# EAGLE design tester (EAGLE 7.7.0)
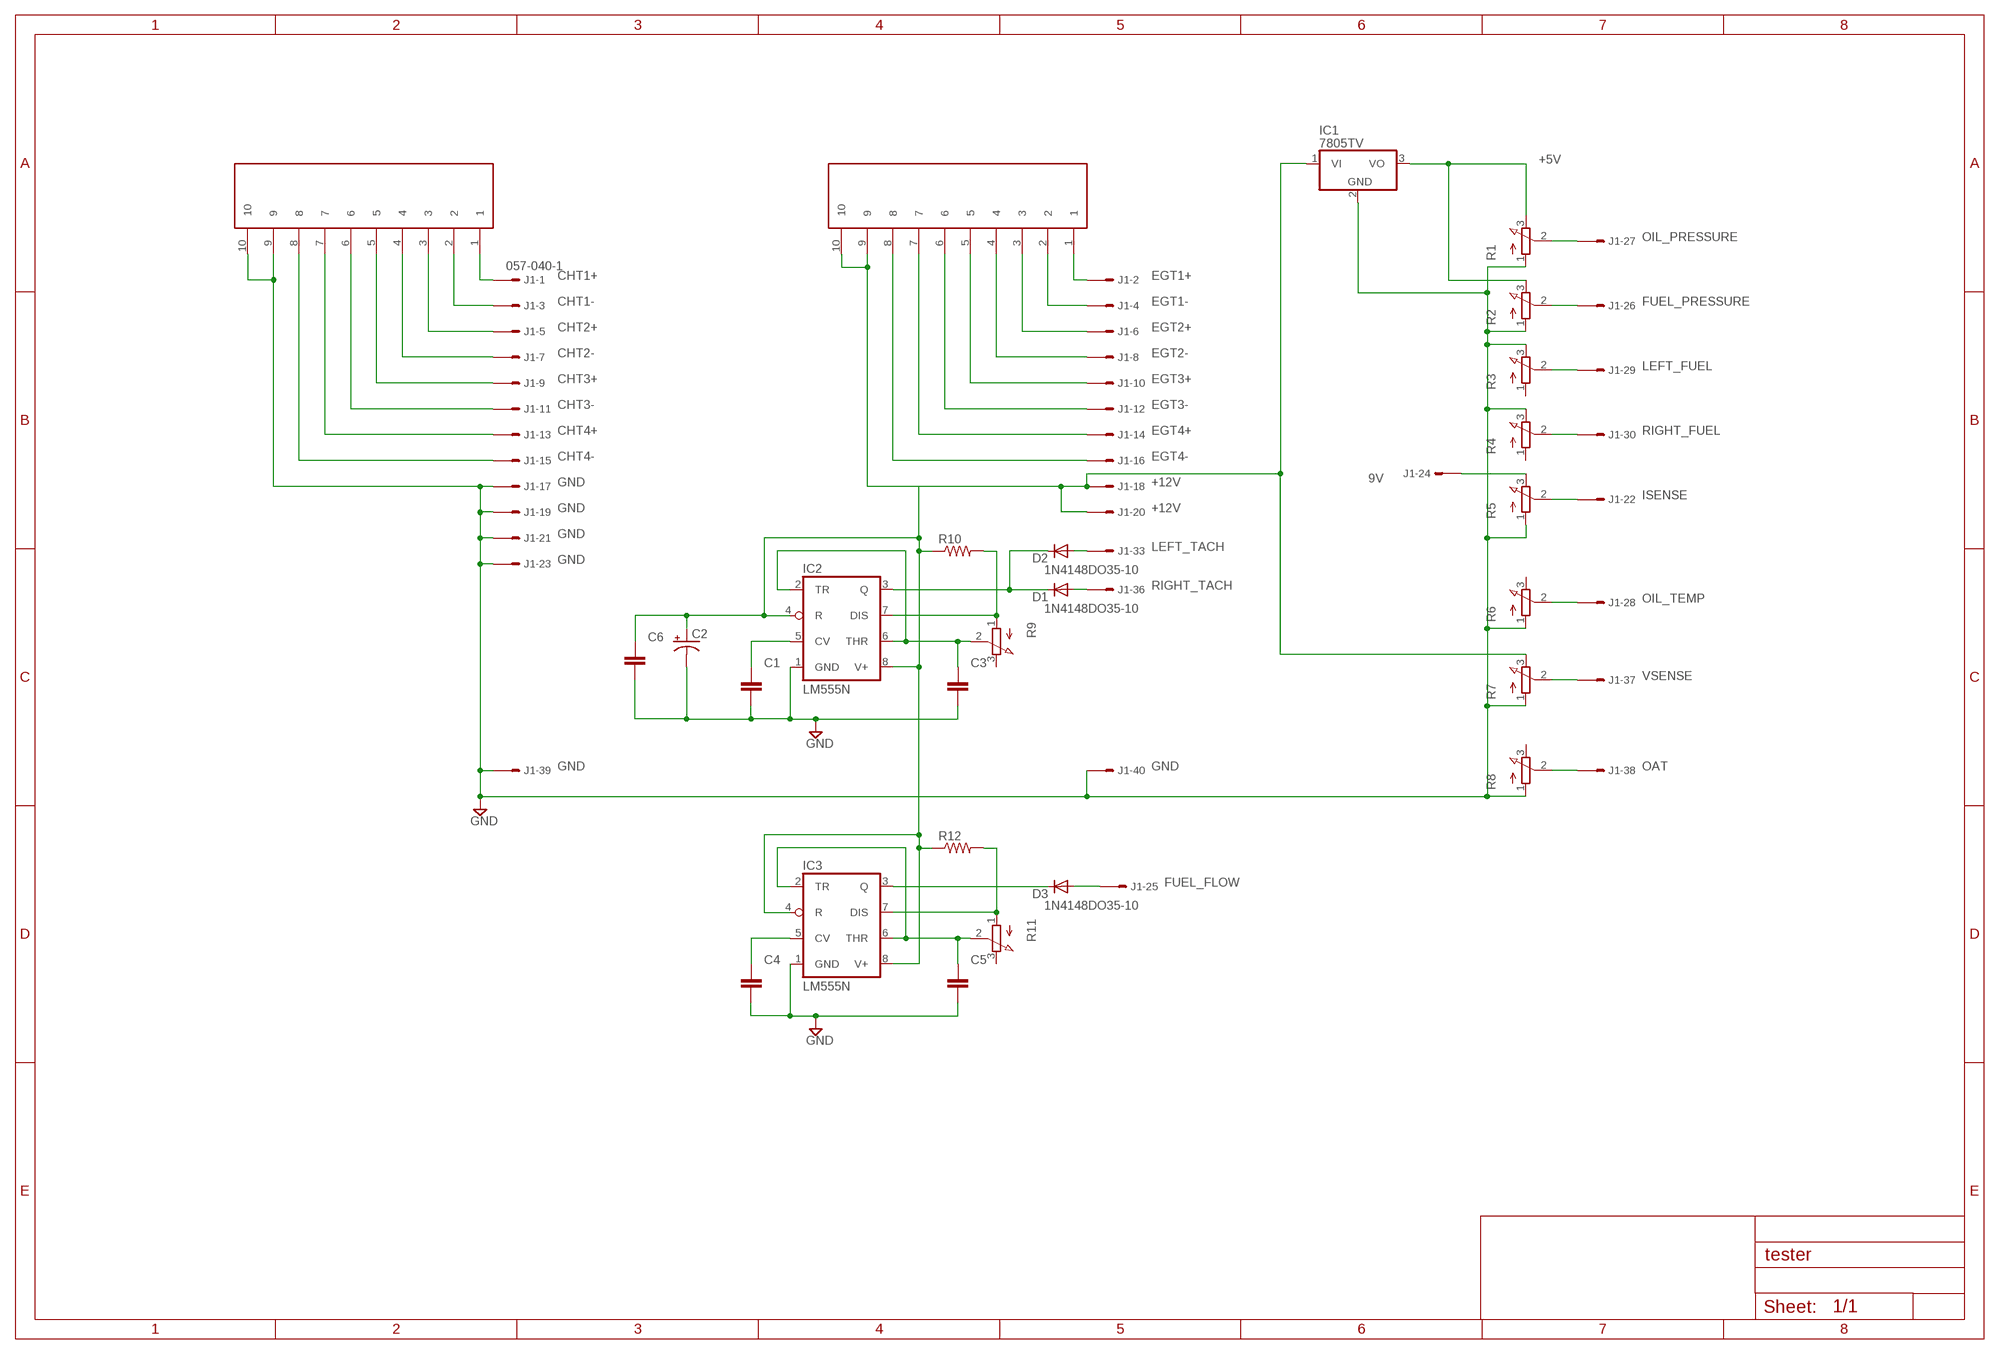
[diagram p0: schematic, sheet 1]

## Parts
C1  CAPACITOR_NPOL-PTH_0.1"  [C0.1PTH]
C2  CAP_POLPTH2  [CPOL-RADIAL-10UF-25V]
C3  CAPACITOR_NPOL-PTH_0.1"  [C0.1PTH]
C4  CAPACITOR_NPOL-PTH_0.1"  [C0.1PTH]
C5  CAPACITOR_NPOL-PTH_0.1"  [C0.1PTH]
C6  CAPACITOR_NPOL-PTH_0.1"  [C0.1PTH]
D1  1N4148DO35-10  [DO35-10]
D2  1N4148DO35-10  [DO35-10]
D3  1N4148DO35-10  [DO35-10]
IC1  7805TV  [TO220V]
IC2  LM555N  [DIL08]
IC3  LM555N  [DIL08]
J1  057-040-1  [057-040-1]
R1  3RP/1610N  [3RP/1610N]
R2  3RP/1610N  [3RP/1610N]
R3  3RP/1610N  [3RP/1610N]
R4  3RP/1610N  [3RP/1610N]
R5  3RP/1610N  [3RP/1610N]
R6  3RP/1610N  [3RP/1610N]
R7  3RP/1610N  [3RP/1610N]
R8  3RP/1610N  [3RP/1610N]
R9  3RP/1610N  [3RP/1610N]
R10  RESISTORPTH-1/4W  [AXIAL-0.4]
R11  3RP/1610N  [3RP/1610N]
R12  RESISTORPTH-1/4W  [AXIAL-0.4]
TB2  282847-10  [282847-10]
TB4  282847-10  [282847-10]

## Nets
9V: J1.24 R5.3(E)
+5V: IC1.3(VO) R1.3(E) R2.3(E)
+12V: C2.1(+) C6.1 IC1.1(VI) IC2.4(R) IC2.8(V+) IC3.4(R) IC3.8(V+) J1.18 J1.20 R7.3(E) R10.P$1 R12.P$1 TB4.9 TB4.10
CHT1+: J1.1 TB2.1
CHT1-: J1.3 TB2.2
CHT2+: J1.5 TB2.3
CHT2-: J1.7 TB2.4
CHT3+: J1.9 TB2.5
CHT3-: J1.11 TB2.6
CHT4+: J1.13 TB2.7
CHT4-: J1.15 TB2.8
EGT1+: J1.2 TB4.1
EGT1-: J1.4 TB4.2
EGT2+: J1.6 TB4.3
EGT2-: J1.8 TB4.4
EGT3+: J1.10 TB4.5
EGT3-: J1.12 TB4.6
EGT4+: J1.14 TB4.7
EGT4-: J1.16 TB4.8
FF: C5.1 IC3.2(TR) IC3.6(THR) R11.2(S)
FUEL_FLOW: D3.A J1.25
FUEL_PRESSURE: J1.26 R2.2(S)
GND: C1.2 C2.2(-) C3.2 C4.2 C5.2 C6.2 IC1.2(GND) IC2.1(GND) IC3.1(GND) J1.17 J1.19 J1.21 J1.23 J1.39 J1.40 R1.1(A) R2.1(A) R3.3(E) R4.3(E) R5.1(A) R6.1(A) R7.1(A) R8.1(A) TB2.9 TB2.10
ISENSE: J1.22 R5.2(S)
LEFT_FUEL: J1.29 R3.2(S)
LEFT_TACH: D2.A J1.33
N$3: C1.1 IC2.5(CV)
N$4: IC2.7(DIS) R9.1(A) R10.P$2
N$7: D1.C D2.C IC2.3(Q)
N$8: C4.1 IC3.5(CV)
N$9: IC3.7(DIS) R11.1(A) R12.P$2
N$11: D3.C IC3.3(Q)
OAT: J1.38 R8.2(S)
OIL_PRESSURE: J1.27 R1.2(S)
OIL_TEMP: J1.28 R6.2(S)
RIGHT_FUEL: J1.30 R4.2(S)
RIGHT_TACH: D1.A J1.36
RPM: C3.1 IC2.2(TR) IC2.6(THR) R9.2(S)
VSENSE: J1.37 R7.2(S)
Unconnected: J1.31 J1.32 J1.34 J1.35 R3.1(A) R4.1(A) R6.3(E) R8.3(E) R9.3(E) R11.3(E)

## Library data of the parts
C1 C3-C6 = kotuku:CAPACITOR_NPOL: Non-Polarized capacitor in various packages
C2 = kotuku:CAP_POL: Capacitor Polarized These are standard SMD and PTH capacitors. Normally 10uF, 47uF, and 100uF in electrolytic and tantalum varieties. Always verify the external diameter of the through hole cap, it varies with capacity, voltage, and manufacturer. The EIA devices should be standard.
D1-D3 = diode:1N4148: DIODE high speed (Philips)
IC1 = linear:78*: Positive VOLTAGE REGULATOR Source: http://cache.national.com/ds/LM/LM78L05.pdf http://www.fairchildsemi.com/ds/LM/LM7805.pdf
IC2 IC3 = linear:*555: TIMER
J1 = con-panduit-changed:057-040-: CONNECTOR 40-pin series 057 contact pc board low profile headers; OC_FARNELL: unknown; OC_NEWARK: unknown; PARTNO: SBH11-PBPC-D20-ST-BK
R1-R9 R11 = pot:3RP/1610N: 16mm Potentiometer one level Source: http://www.alphapotentiometers.net/html/16mm_pot_2.html
R10 R12 = kotuku:RESISTOR: Resistor Basic schematic elements and footprints for 0603, 1206, and PTH resistors.
TB2 TB4 = TEConnectivity:282847-10; PARTNO: 1-282847-0

## Board
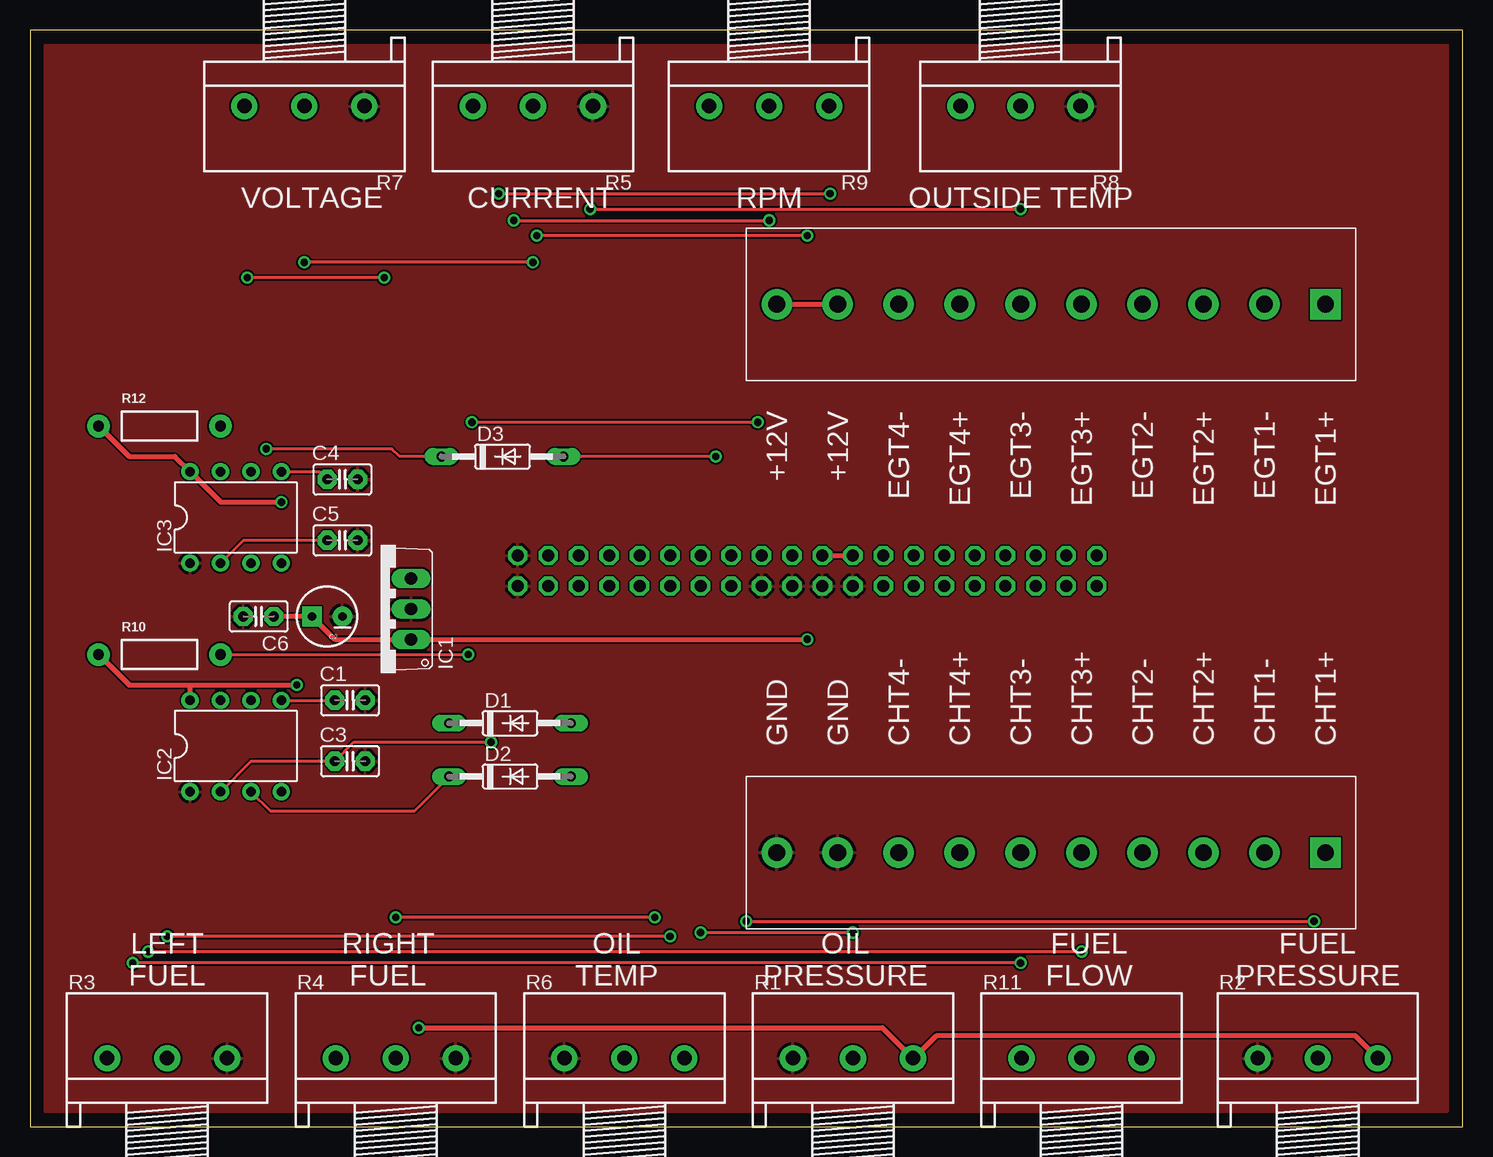
[diagram p1: board, top side]
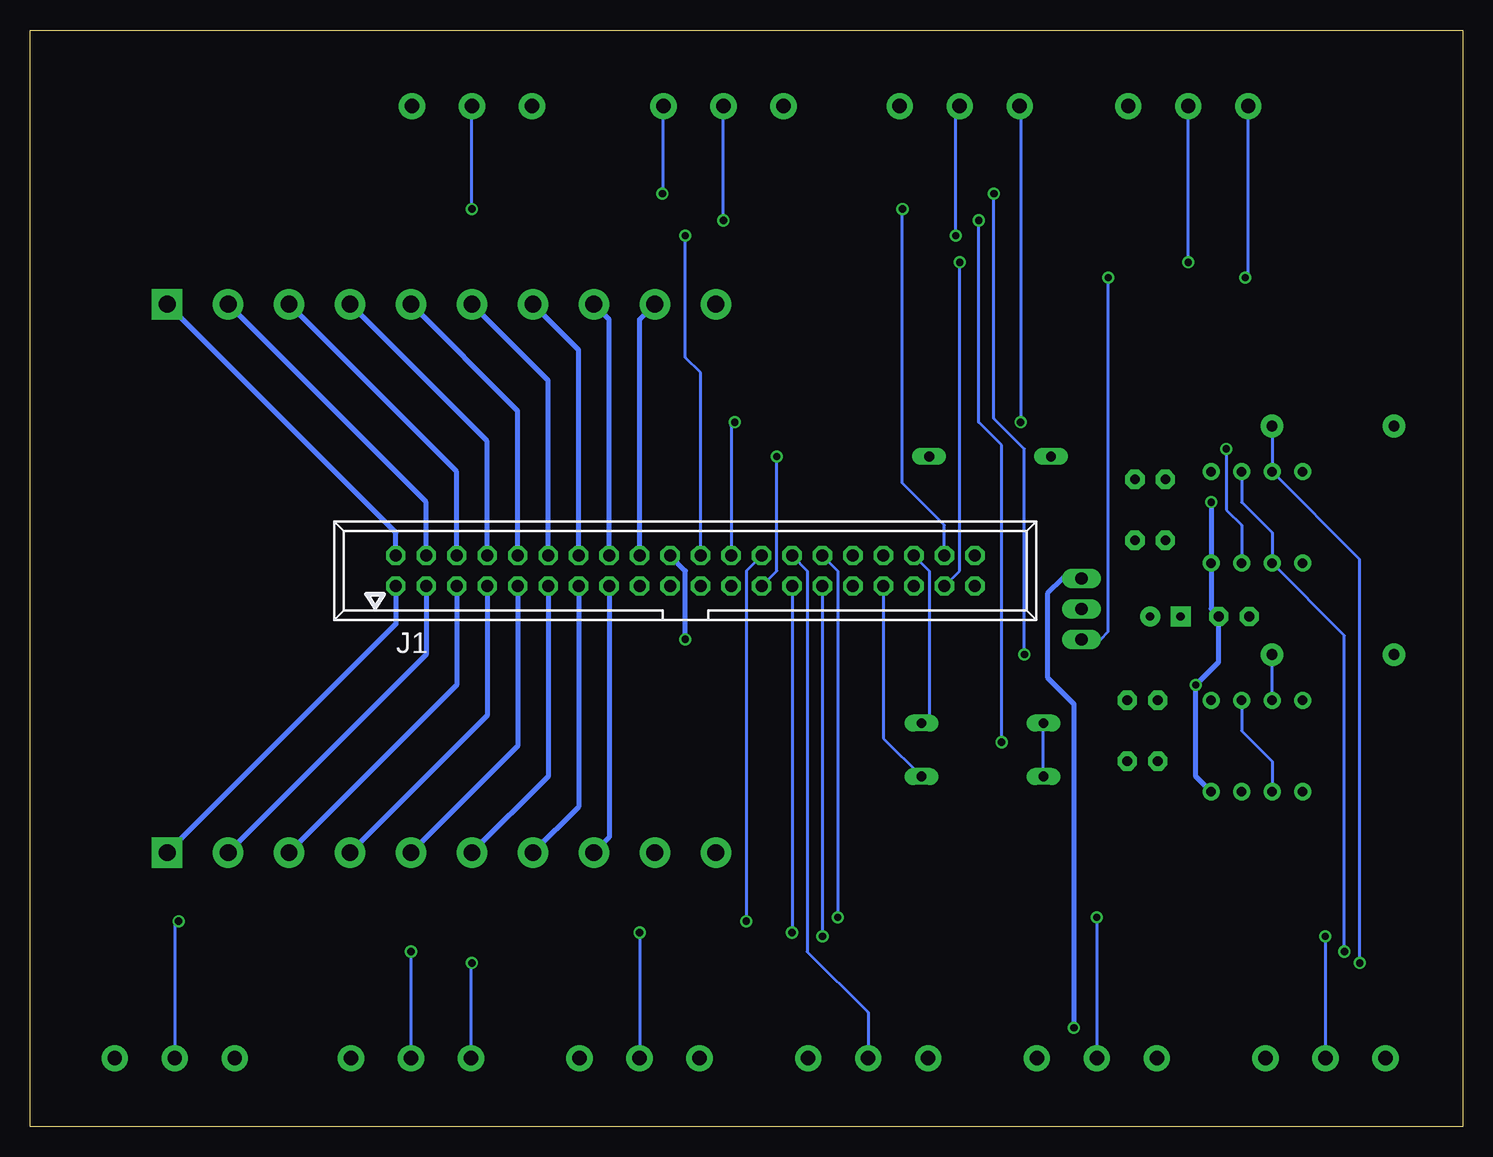
[diagram p2: board, bottom side, seen from below]

Size 119.38 x 91.44 mm. Coordinates in mm from the lower left corner, seen from the top.
Outline: 0,0 119.38,0 119.38,91.44 0,91.44 0,0
Copper layers (1*16): Top 0.035mm / dielectric 1.5mm / Bottom 0.035mm
Design rules "DFRobot_Eagle_Rule_v0.4": minimum track width 6mil, minimum drill 12mil, track to track 6mil, track to pad 6mil, pad to pad 6mil, via to via 6mil, smd to smd 0mil, copper to edge 10mil, drill to drill 10mil, minimum pad ring 12mil, minimum via ring 8mil, stop-mask expansion 2mil, vias tented up to drill 25mil, thermal gap 10mil

### Footprints (pad centres in the part's own frame; a part is rotated, then mirrored left to right if it is on the bottom)
C0.1PTH = drill 0.813 pad 1.6 octagon: 1 -1.27,0; 2 1.27,0
CPOL-RADIAL-10UF-25V = drill 0.7 pad 1.651 square: 1 1.27,0 | drill 0.7 pad 1.651: 2 -1.27,0
DO35-10 = drill 0.813 long: A 5.08,0; C -5.08,0
TO220V = drill 1.016 long: 1 -2.54,-2.54; 2 0,-2.54; 3 2.54,-2.54
DIL08 = drill 0.813 pad 1.27: 1 -3.81,-3.81; 2 -1.27,-3.81; 3 1.27,-3.81; 4 3.81,-3.81; 5 3.81,3.81; 6 1.27,3.81; 7 -1.27,3.81; 8 -3.81,3.81
057-040-1 = drill 1 octagon: 1 -24.13,-1.27; 2 -24.13,1.27; 3 -21.59,-1.27; 4 -21.59,1.27; 5 -19.05,-1.27; 6 -19.05,1.27; 7 -16.51,-1.27; 8 -16.51,1.27; 9 -13.97,-1.27; 10 -13.97,1.27; 11 -11.43,-1.27; 12 -11.43,1.27; 13 -8.89,-1.27; 14 -8.89,1.27; 15 -6.35,-1.27; 16 -6.35,1.27; 17 -3.81,-1.27; 18 -3.81,1.27; 19 -1.27,-1.27; 20 -1.27,1.27; 21 1.27,-1.27; 22 1.27,1.27; 23 3.81,-1.27; 24 3.81,1.27; 25 6.35,-1.27; 26 6.35,1.27; 27 8.89,-1.27; 28 8.89,1.27; 29 11.43,-1.27; 30 11.43,1.27; 31 13.97,-1.27; 32 13.97,1.27; 33 16.51,-1.27; 34 16.51,1.27; 35 19.05,-1.27; 36 19.05,1.27; 37 21.59,-1.27; 38 21.59,1.27; 39 24.13,-1.27; 40 24.13,1.27
3RP/1610N = drill 1.2 pad 2.184: 1 -5,0; 2 0,0; 3 5,0
AXIAL-0.4 = drill 0.9 pad 1.88: P$1 -5.08,0; P$2 5.08,0
282847-10 = drill 1.4 pad 2.54 square: 1 0,0 | drill 1.4 pad 2.54: 2 5.08,0; 3 10.16,0; 4 15.24,0; 5 20.32,0; 6 25.4,0; 7 30.48,0; 8 35.56,0; 9 40.64,0; 10 45.72,0

### Placement (x,y rotation side)
C1  26.67,35.56 0 top
C2  24.77,42.55 180 top
C3  26.67,30.48 0 top
C4  26.04,53.98 0 top
C5  26.04,48.9 0 top
C6  19.05,42.55 180 top
D1  40.01,33.66 0 top
D2  40.01,29.21 0 top
D3  39.37,55.88 0 top
IC1  29.21,43.18 90 top
IC2  17.14,31.75 0 top
IC3  17.14,50.8 0 top
J1  64.77,46.35 0 bottom
R1  68.58,5.71 0 top
R2  107.31,5.71 0 top
R3  11.43,5.71 0 top
R4  30.48,5.71 0 top
R5  41.91,85.09 180 top
R6  49.53,5.71 0 top
R7  22.86,85.09 180 top
R8  82.55,85.09 180 top
R9  61.59,85.09 180 top
R10  10.79,39.37 0 top
R11  87.63,5.71 0 top
R12  10.79,58.42 0 top
TB2  107.95,22.86 180 top
TB4  107.95,68.58 180 top

### Tracks (layer width: path | path; a pad name or v marks a point on that pad's centre or on a via)
9V  (via drill 0.6)
  Top 0.254: v36.83,58.74 v60.64,58.74
  Bottom 0.254: R5.3 36.83,85.01 v36.83,58.74 | v60.64,58.74 60.96,58.42 J1.24
+5V  (via drill 0.6)
  Top 0.406: R2.3 110.41,7.62 75.56,7.62 73.66,5.71 R1.3 71.04,8.26 v32.38,8.26
  Bottom 0.406: IC1.3 33.34,45.72 34.61,44.45 34.61,37.47 32.38,35.24 v32.38,8.26
+12V  (via drill 0.6)
  Top 0.254: v29.53,70.8 v18.1,70.8
  Top 0.406: v64.77,40.64 IC1.1 25.4,40.64 C2.1 C6.1 | J1.20 J1.18 | TB4.10 TB4.9 | IC2.8 13.34,36.83 | 13.34,36.83 v22.23,36.83 | R10.P$1 8.26,36.83 13.34,36.83 | R12.P$1 8.26,55.88 12.06,55.88 IC3.8 15.88,52.07 v20.95,52.07
  Bottom 0.254: IC1.1 30.16,40.64 29.53,41.27 v29.53,70.8 | v18.1,70.8 17.86,71.04 R7.3
  Bottom 0.406: v64.77,40.64 64.77,46.35 J1.20 | J1.18 68.58,67.31 TB4.9 | IC2.4 22.23,29.21 v22.23,36.83 20.32,38.73 C6.1 20.95,43.18 IC3.4 v20.95,52.07
CHT1+
  Bottom 0.406: J1.1 88.9,41.91 TB2.1
CHT1-
  Bottom 0.406: J1.3 86.36,39.37 TB2.2
CHT2+
  Bottom 0.406: J1.5 83.82,36.83 TB2.3
CHT2-
  Bottom 0.406: J1.7 81.28,34.29 TB2.4
CHT3+
  Bottom 0.406: J1.9 78.74,31.75 TB2.5
CHT3-
  Bottom 0.406: J1.11 76.2,29.21 TB2.6
CHT4+
  Bottom 0.406: J1.13 73.66,26.67 TB2.7
CHT4-
  Bottom 0.406: J1.15 71.12,24.13 TB2.8
EGT1+
  Bottom 0.406: J1.2 88.9,49.53 TB4.1
EGT1-
  Bottom 0.406: J1.4 86.36,52.07 TB4.2
EGT2+
  Bottom 0.406: J1.6 83.82,54.61 TB4.3
EGT2-
  Bottom 0.406: J1.8 81.28,57.15 TB4.4
EGT3+
  Bottom 0.406: J1.10 78.74,59.69 TB4.5
EGT3-
  Bottom 0.406: J1.12 76.2,62.23 TB4.6
EGT4+
  Bottom 0.406: J1.14 73.66,64.77 TB4.7
EGT4-
  Bottom 0.406: J1.16 71.12,67.31 TB4.8
FF  (via drill 0.6)
  Top 0.254: C5.1 17.78,48.9 IC3.2 | v87.63,14.61 v9.84,14.61
  Bottom 0.254: IC3.6 18.41,52.07 15.88,49.53 IC3.2 9.84,40.96 v9.84,14.61 | R11.2 v87.63,14.61
FUEL_FLOW  (via drill 0.6)
  Top 0.254: v57.15,55.88 D3.A
  Bottom 0.254: J1.25 57.15,46.35 v57.15,55.88
FUEL_PRESSURE  (via drill 0.6)
  Top 0.254: v59.69,17.14 v107,17.14
  Bottom 0.254: J1.26 59.69,46.35 v59.69,17.14 | v107,17.14 107.31,16.83 R2.2
GND
  pour Top: 1.27,90.17 118.11,90.17 118.11,1.27 1.27,1.27
ISENSE  (via drill 0.6)
  Top 0.254: v64.77,74.3 v42.23,74.3
  Bottom 0.254: J1.22 63.5,62.87 64.77,64.14 v64.77,74.3 | v42.23,74.3 42.23,84.77 R5.2
LEFT_FUEL  (via drill 0.6)
  Top 0.254: v53.34,15.88 v11.43,15.88
  Bottom 0.254: J1.29 v53.34,15.88 | v11.43,15.88 R3.2
LEFT_TACH
  Bottom 0.254: J1.33 48.26,32.38 D2.A
N$3
  Top 0.254: IC2.5 C1.1
N$4  (via drill 0.6)
  Top 0.254: R10.P$2 v36.51,39.37 | v39.05,77.79 v66.67,77.79
  Bottom 0.254: IC2.7 R10.P$2 | v36.51,39.37 36.51,56.52 39.05,59.05 v39.05,77.79 | v66.67,77.79 66.59,77.87 R9.1
N$7
  Top 0.254: IC2.3 20,26.35 32.07,26.35 D2.C
  Bottom 0.254: D2.C D1.C
N$8
  Top 0.254: IC3.5 24.13,54.61 C4.1
N$9  (via drill 0.6)
  Top 0.254: v82.55,13.65 v8.57,13.65
  Bottom 0.254: R12.P$2 IC3.7 8.57,47.31 v8.57,13.65 | R11.1 82.63,13.57 v82.55,13.65
N$11  (via drill 0.6)
  Top 0.254: D3.C 30.8,55.88 30.16,56.52 v19.68,56.52
  Bottom 0.254: v19.68,56.52 19.68,51.44 18.41,50.16 IC3.3
OAT  (via drill 0.6)
  Top 0.254: v46.67,76.52 v82.55,76.52
  Bottom 0.254: J1.38 43.18,50.16 46.67,53.66 v46.67,76.52 | v82.55,76.52 R8.2
OIL_PRESSURE  (via drill 0.6)
  Top 0.254: v55.88,16.19 v68.58,16.19
  Bottom 0.254: J1.27 v55.88,16.19 | v68.58,16.19 R1.2
OIL_TEMP
  Bottom 0.254: J1.28 54.61,46.35 54.61,14.61 49.53,9.53 R6.2
RIGHT_FUEL  (via drill 0.6)
  Top 0.254: v52.07,17.46 v30.48,17.46
  Bottom 0.254: J1.30 52.07,46.35 v52.07,17.46 | v30.48,17.46 R4.2
RIGHT_TACH
  Bottom 0.254: J1.36 44.45,46.35 44.45,34.29 D1.A
RPM  (via drill 0.6)
  Top 0.254: IC2.2 18.41,30.48 C3.1 26.99,32.07 v38.42,32.07 | v40.32,75.56 v61.59,75.56
  Bottom 0.254: IC2.6 18.41,33.02 15.88,30.48 IC2.2 | v38.42,32.07 38.42,56.83 40.32,58.74 v40.32,75.56 | v61.59,75.56 R9.2
VSENSE  (via drill 0.6)
  Top 0.254: v41.91,72.07 v22.86,72.07
  Bottom 0.254: J1.37 41.91,46.35 v41.91,72.07 | v22.86,72.07 R7.2

### Text on the board
tNames: VOLTAGE | CURRENT | RPM | OUTSIDE TEMP | +12V | +12V | EGT4- | EGT4+ | EGT3- | EGT3+ | EGT2- | EGT2+ | EGT1- | EGT1+ | GND | GND | CHT4- | CHT4+ | CHT3- | CHT3+ | CHT2- | CHT2+ | CHT1- | CHT1+ | LEFT / FUEL | RIGHT / FUEL | OIL / TEMP | OIL / PRESSURE | FUEL / FLOW | FUEL / PRESSURE